# Altium schematic sheet 04_AD623.SchDoc
size A4
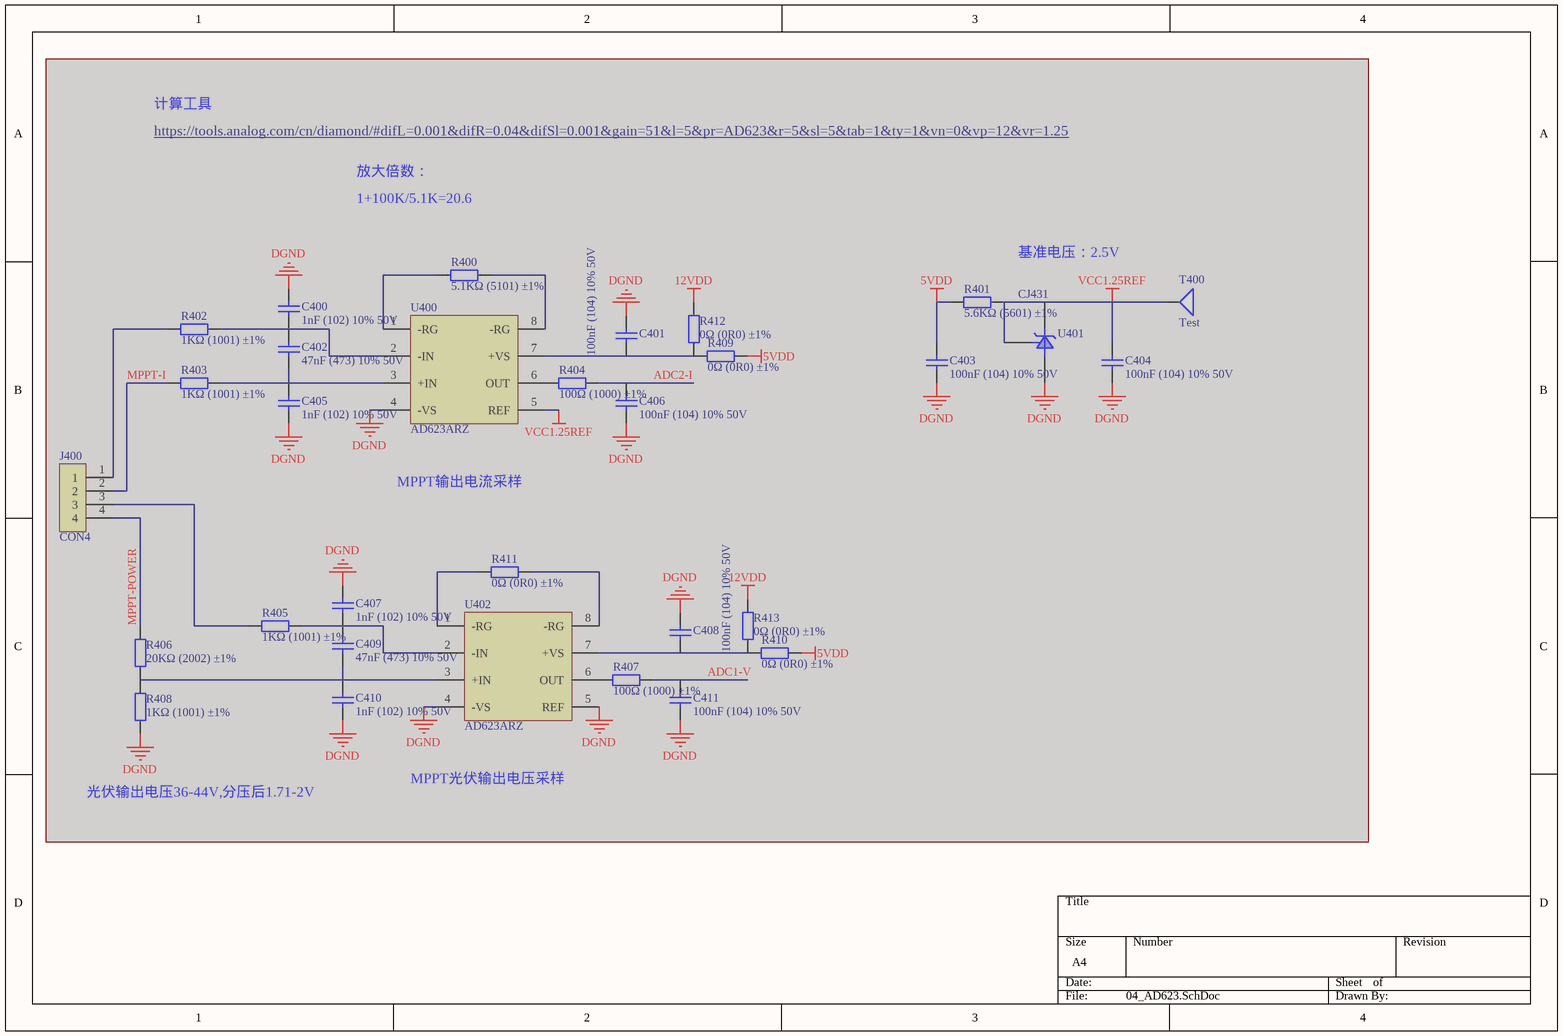
[diagram p0: 04_AD623.SchDoc]

## Parts
C400  1nF (102) 10% 50V  [0603_C]  (masked out: inside a compile mask, not in the netlist)
C401  100nF (104) 10% 50V  [0603_C]  (masked out: inside a compile mask, not in the netlist)
C402  47nF (473) 10% 50V  [0603_C]  (masked out: inside a compile mask, not in the netlist)
C403  100nF (104) 10% 50V  [0603_C]  (masked out: inside a compile mask, not in the netlist)
C404  100nF (104) 10% 50V  [0603_C]  (masked out: inside a compile mask, not in the netlist)
C405  1nF (102) 10% 50V  [0603_C]  (masked out: inside a compile mask, not in the netlist)
C406  100nF (104) 10% 50V  [0603_C]  (masked out: inside a compile mask, not in the netlist)
C407  1nF (102) 10% 50V  [0603_C]  (masked out: inside a compile mask, not in the netlist)
C408  100nF (104) 10% 50V  [0603_C]  (masked out: inside a compile mask, not in the netlist)
C409  47nF (473) 10% 50V  [0603_C]  (masked out: inside a compile mask, not in the netlist)
C410  1nF (102) 10% 50V  [0603_C]  (masked out: inside a compile mask, not in the netlist)
C411  100nF (104) 10% 50V  [0603_C]  (masked out: inside a compile mask, not in the netlist)
J400  CON4  [XH2.54-4P]  (masked out: inside a compile mask, not in the netlist)
R400  5.1KΩ (5101) ±1%  [0603_R]  (masked out: inside a compile mask, not in the netlist)
R401  5.6KΩ (5601) ±1%  [0603_R]  (masked out: inside a compile mask, not in the netlist)
R402  1KΩ (1001) ±1%  [0603_R]  (masked out: inside a compile mask, not in the netlist)
R403  1KΩ (1001) ±1%  [0603_R]  (masked out: inside a compile mask, not in the netlist)
R404  100Ω (1000) ±1%  [0603_R]  (masked out: inside a compile mask, not in the netlist)
R405  1KΩ (1001) ±1%  [0603_R]  (masked out: inside a compile mask, not in the netlist)
R406  20KΩ (2002) ±1%  [0603_R]  (masked out: inside a compile mask, not in the netlist)
R407  100Ω (1000) ±1%  [0603_R]  (masked out: inside a compile mask, not in the netlist)
R408  1KΩ (1001) ±1%  [0603_R]  (masked out: inside a compile mask, not in the netlist)
R409  0Ω (0R0) ±1%  [0603_R]  (masked out: inside a compile mask, not in the netlist)
R410  0Ω (0R0) ±1%  [0603_R]  (masked out: inside a compile mask, not in the netlist)
R411  0Ω (0R0) ±1%  [0603_R]  (masked out: inside a compile mask, not in the netlist)
R412  0Ω (0R0) ±1%  [0603_R]  (masked out: inside a compile mask, not in the netlist)
R413  0Ω (0R0) ±1%  [0603_R]  (masked out: inside a compile mask, not in the netlist)
T400  Test  [Testpoint]  (masked out: inside a compile mask, not in the netlist)
U400  AD623ARZ  [SOIC8]  (masked out: inside a compile mask, not in the netlist)
U401  CJ431  [ME432]  (masked out: inside a compile mask, not in the netlist)
U402  AD623ARZ  [SOIC8]  (masked out: inside a compile mask, not in the netlist)

## Notes on the sheet
- 计算工具
- https://tools.analog.com/cn/diamond/#difL=0.001&difR=0.04&difSl=0.001&gain=51&l=5&pr=AD623&r=5&sl=5&tab=1&ty=1&vn=0&vp=12&vr=1.25
- 放大倍数：
- 1+100K/5.1K=20.6
- 基准电压：2.5V
- MPPT输出电流采样
- MPPT光伏输出电压采样
- 光伏输出电压36-44V,分压后1.71-2V

## Library data of the parts
C400 C405 C407 C410 = 0603 1nF (102) 10% 50V: 贴片电容; ComponentLink1Description: 供应商链接; ComponentLink1URL: http://www.szlcsc.com/product/details_1940.html; Package: 0603; Supplier: LC; SuppliersPartNumber: C1588
C401 C403 C404 C406 C408 C411 = 0603 100nF (104) 10% 50V: 贴片电容; ComponentLink1Description: 供应商链接; ComponentLink1URL: http://www.szlcsc.com/product/details_15331.html; Package: 0603; Supplier: LC; SuppliersPartNumber: C14663
C402 C409 = 0603 47nF (473) 10% 50V: 贴片电容; ComponentLink1Description: 供应商链接; ComponentLink1URL: http://www.szlcsc.com/product/details_1974.html; Package: 0603; Supplier: LC; SuppliersPartNumber: C1622
R400 = 0603 5.1KΩ (5101) 1%: 贴片电阻; ComponentLink1Description: 供应商链接; ComponentLink1URL: http://www.szlcsc.com/product/details_23913.html; Package: 0603; Supplier: LC; SuppliersPartNumber: C23186
R401 = 0603 5.6KΩ (5601) 1%: 贴片电阻; ComponentLink1Description: 供应商链接; ComponentLink1URL: http://www.szlcsc.com/product/details_23916.html; Package: 0603; Supplier: LC; SuppliersPartNumber: C23189
R402 R403 R405 R408 = 0603 1KΩ (1001) 1%: 贴片电阻; ComponentLink1Description: 供应商链接; ComponentLink1URL: http://www.szlcsc.com/product/details_21904.html; Package: 0603; Supplier: LC; SuppliersPartNumber: C21190
R404 R407 = 0603 100Ω (1000) 1%: 贴片电阻; ComponentLink1Description: 供应商链接; ComponentLink1URL: http://www.szlcsc.com/product/details_23502.html; Package: 0603; Supplier: LC; SuppliersPartNumber: C22775
R406 = 0603 20KΩ (2002) 1%: 贴片电阻; ComponentLink1Description: 供应商链接; ComponentLink1URL: http://www.szlcsc.com/product/details_4591.html; Package: 0603; Supplier: LC; SuppliersPartNumber: C4184
R409-R413 = 0603 0Ω (0R0) 1%: 贴片电阻; ComponentLink1Description: 供应商链接; ComponentLink1URL: http://www.szlcsc.com/product/details_21903.html; Package: 0603; Supplier: LC; SuppliersPartNumber: C21189
T400 = TestPad
U400 U402 = AD623
U401 = CJ431 0.5%431: 电压基准; ComponentLink1Description: 供应商链接; ComponentLink1URL: http://www.szlcsc.com/product/details_3500.html; Package: SOT-23; Supplier: LC; SuppliersPartNumber: C3113